# Altium schematic sheet POWR0001_BCR_LT1513.SchDoc: BLUEsat Battery Charge Regulator
size A3; Engineer: T. FISK; Organization: BLUEsat Project; Address1: Room 419; Address2: School of EE&T; Address3: UNSW, NSW 2052; Address4: Australia; SheetNumber: 1; SheetTotal: 1; Description: Battery charge regulator based on LT1513-2; Version: 1.1
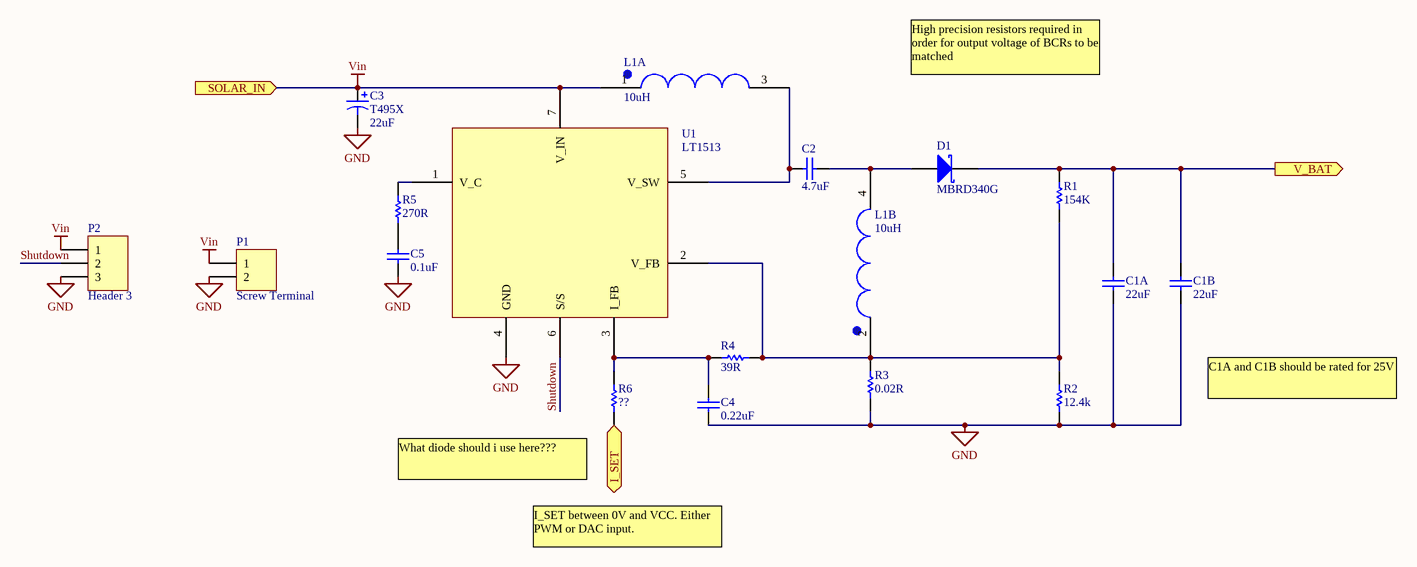
[diagram p0: POWR0001_BCR_LT1513.SchDoc]

## Parts
C1A  value 22uF  [CAPC3225M]  (hidden comment: Cap)
C1B  value 22uF  [CAPC3225M]  (hidden comment: Cap)
C2  value 4.7uF  [CAPC3225M]  (hidden comment: Cap)
C3  T495X  value 22uF  [X]
C4  value 0.22uF  [CAPC3216M]  (hidden comment: Cap)
C5  value 0.1uF  [CAPC3216M]  (hidden comment: Cap)
D1  MBRD340G  [TO229P990X238-3N]
L1  value 10uH  [DRQ125]  (hidden comment: DRQ125 Dual Inductor)  (parts A,B of 2)
P1  Screw Terminal  [Screw Header 2]
P2  Header 3  [HDR1X3]
R1  value 154K  [RESC3216M]  (hidden comment: Res1)
R2  value 12.4k  [RESC3216M]  (hidden comment: Res1)
R3  value 0.02R  [RESC3216M]  (hidden comment: Res1)
R4  value 39R  [RESC3216M]  (hidden comment: Res1)
R5  value 270R  [RESC3216M]  (hidden comment: Res1)
R6  value ??  [RESC3216M]  (hidden comment: Res1)
U1  LT1513  [TO152P1396X238-8N]

## Ports
I_SET (in), SOLAR_IN (in), V_BAT (out)

## Nets
GND: C1A.2 C1B.2 C3.2 C4.2 C5.2 P1.2 P2.3 R2.1 R3.1 U1.4(GND)
Vin: C3.1 L1.1 P1.1 P2.1 U1.7(V_IN) ; port SOLAR_IN
I_SET: R6.2 ; port I_SET
Shutdown: P2.2 U1.6(S/S)
V_BAT: C1A.1 C1B.1 D1.2(K) R1.2 ; port V_BAT
NetC2_1: C2.1 D1.1(A) L1.4
NetC2_2: C2.2 L1.3 U1.5(V_SW)
NetC4_1: C4.1 R4.2 R6.1 U1.3(I_FB)
NetC5_1: C5.1 R5.2
NetL1_2: L1.2 R1.1 R2.2 R3.2 R4.1 U1.2(V_FB)
NetR5_1: R5.1 U1.1(V_C)

## Notes on the sheet
- High precision resistors required in order for output voltage of BCRs to be matched
- C1A and C1B should be rated for 25V
- (near R6) What diode should i use here???
- I_SET between 0V and VCC. Either PWM or DAC input.
- Title
- Description:
- Size:
- Author:
- Date:
- A3
- Time:
- Version
- Sheet:
- Drawing No.:
- of
- File:

## Library data of the parts
C1A C1B C2 C4 C5 = Cap: Capacitor; Published: 8-Jun-2000; LatestRevisionDate: 17-Jul-2002; LatestRevisionNote: Re-released for DXP Platform.; PackageReference: RAD-0.3; Publisher: Altium Limited; PackageDescription: Radial Cap, Thru-Hole; 2 Leads; 0.3 in Pin Spacing; Supplier 1: Farnell; Supplier 2: Farnell; Supplier Part Number 2: 1759368
C3 = T495X: Solid Tantalum Chip Capacitor, Standard T495 Series - Low ESR, Surge Robust; PCB_Layout: Round Glue Pad at 2.9 ±0.1mm in diameter at KEMET's option; Published: 17-Jul-2002; LatestRevisionDate: 19-Mar-2004; LatestRevisionNote: Silkscreen dimensions re-sized.; DatasheetDocument: Mar-2001; PackageDocument: Mar-2001; PackageReference: X; Publisher: Altium Limited; Code_JEITA: 7343-43; ComponentLink1Description: Manufacturer Link; ComponentLink1URL: http://www.kemet.com/; ComponentLink2Description: Datasheet; ComponentLink2URL: http://www.kemet.com/kemet/web/homepage/kechome.nsf/vapubfilesname/F3102TA.pdf/$file/F3102TA.pdf
D1 = Diode 11DQ03: Schottky Rectifier; pin to pad: 1>1+3 2>4; Published: 8-Jun-2000; LatestRevisionDate: 17-Jul-2002; LatestRevisionNote: Re-released for DXP Platform.; DatasheetVersion: Dec-1997; PackageReference: DO-204AL; Publisher: Altium Limited; PackageDescription: Diode, Axial; Body 5.2 x 2.7 mm (LxDia. max), Lead Dia. 0.86 mm (max); Code_JEDEC: DO-204-AL; ComponentLink1Description: Manufacturer Link; ComponentLink1URL: http://www.irf.com/; ComponentLink2Description: Datasheet; ComponentLink2URL: http://www.irf.com/product-info/datasheets/data/11dq03.pdf
P1 = Header 2: Header, 2-Pin; LatestRevisionDate: 17-Jul-2002; LatestRevisionNote: Re-released for DXP Platform.; Publisher: Altium Limited
P2 = Header 3: Header, 3-Pin; LatestRevisionDate: 17-Jul-2002; LatestRevisionNote: Re-released for DXP Platform.; Publisher: Altium Limited
R1-R6 = Res1: Resistor; Published: 8-Jun-2000; LatestRevisionDate: 17-Jul-2002; LatestRevisionNote: Re-released for DXP Platform.; PackageReference: AXIAL-0.3; Publisher: Altium Limited; PackageDescription: Axial Device, Thru-Hole; 2 Leads; 0.3 in Pin Spacing; Supplier 1: Farnell